# Altium schematic sheet Server Main Power.schdoc
size 491 x 255 mm
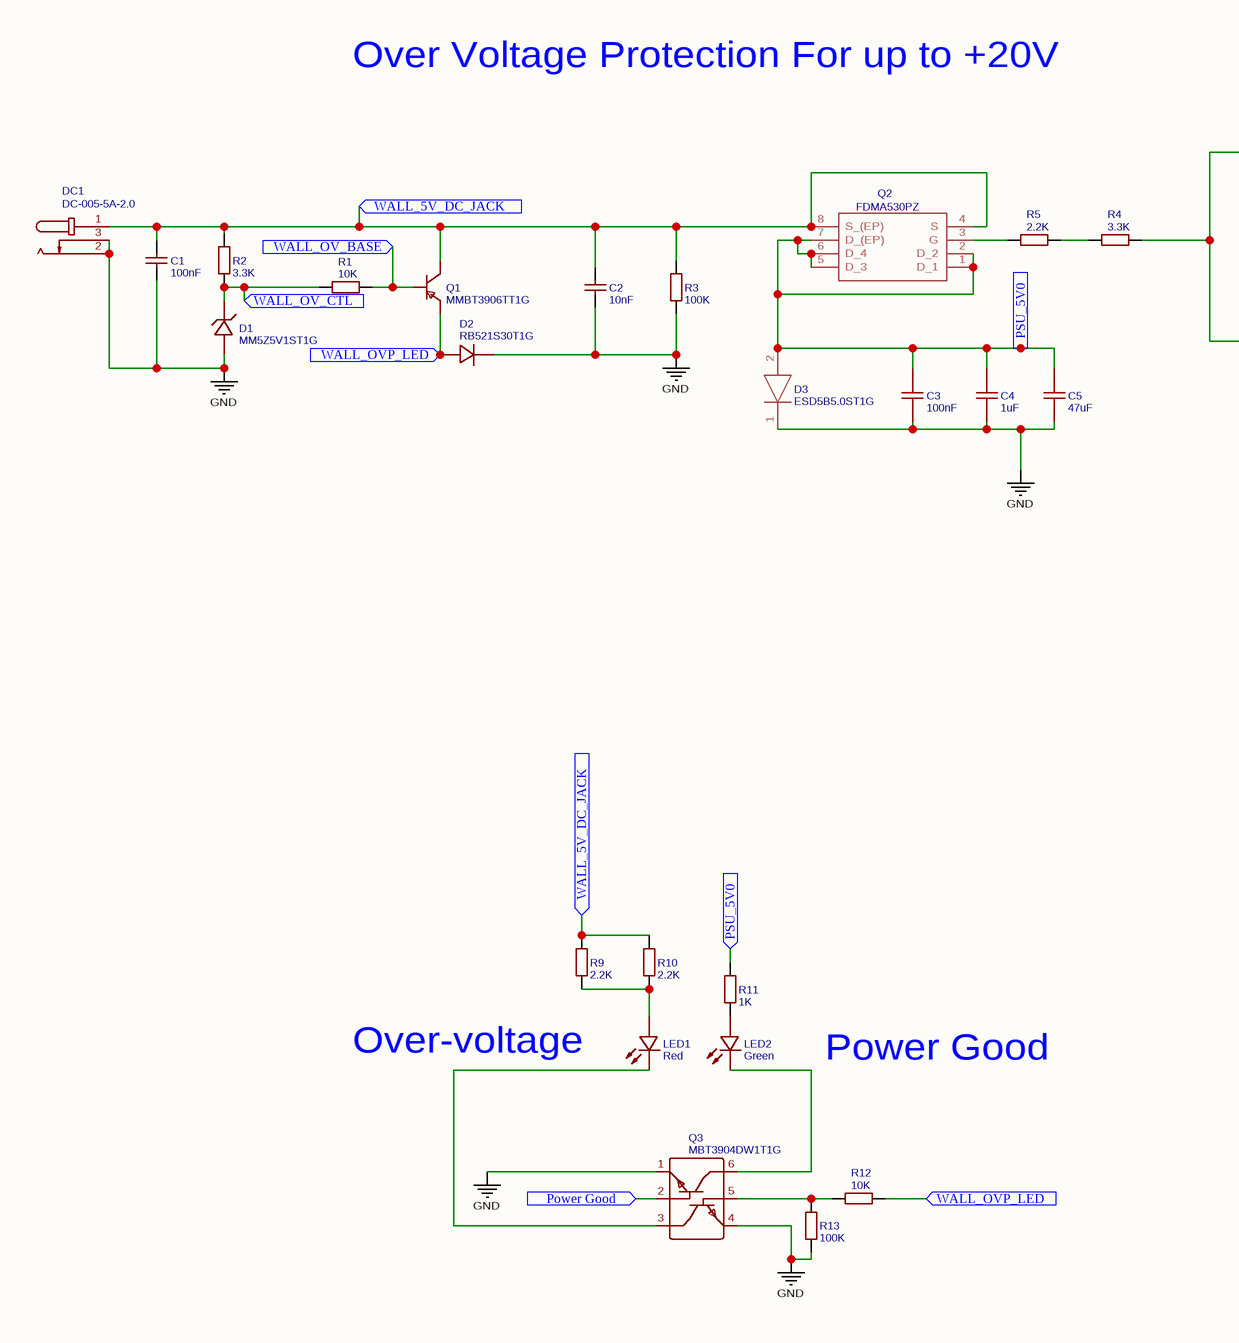
[diagram p0: Server Main Power.schdoc, left]
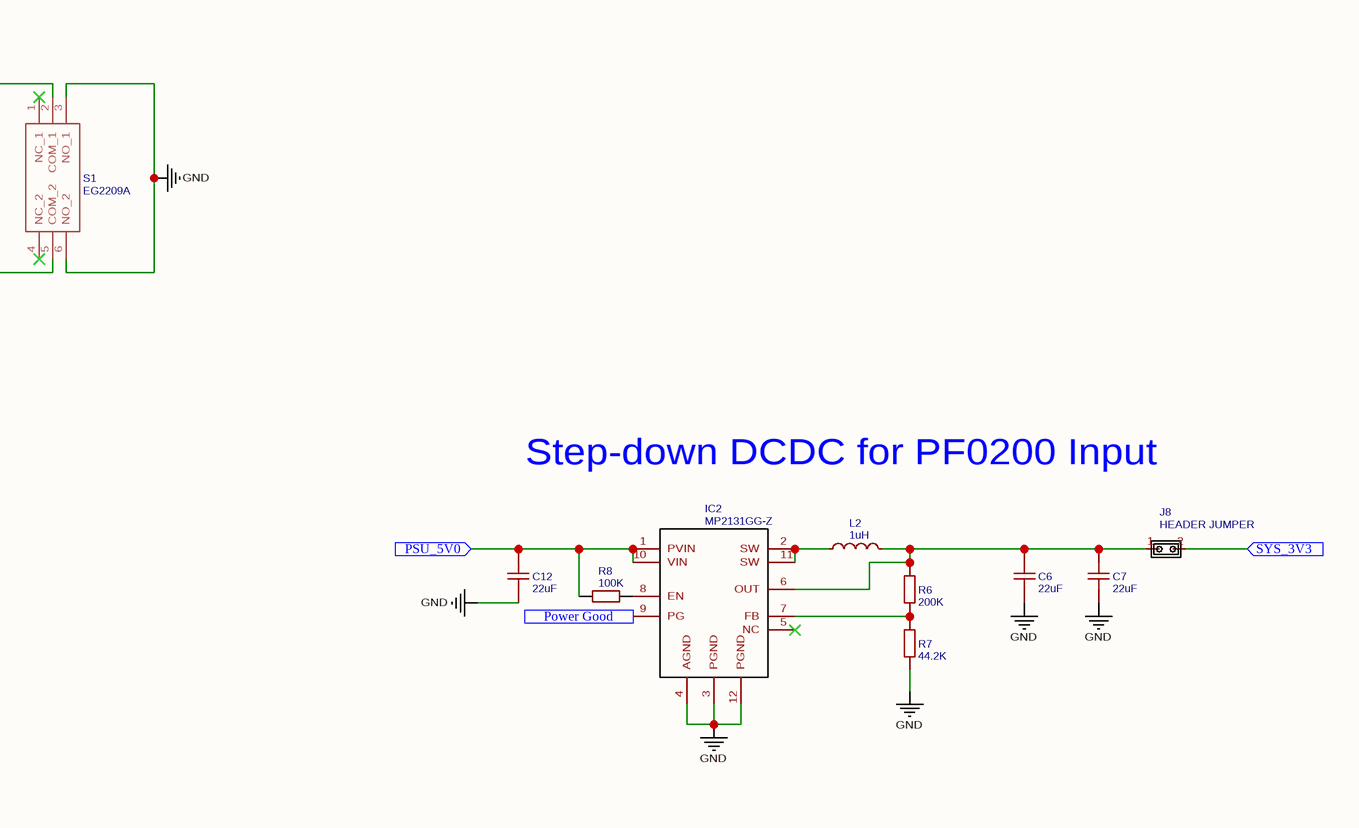
[diagram p1: Server Main Power.schdoc, right]

## Parts
C1  100nF  [C1206]
C2  10nF  [C0402]
C3  100nF  [C0603]
C4  1uF  [C0402]
C5  47uF  [C1206]
C6  22uF  [C0805]
C7  22uF  [C0805]
C12  22uF  [C0805]
D1  MM5Z5V1ST1G  [SOD-523F_L1.7-W0.9-LS1.7-RD]
D2  RB521S30T1G  [SOD-523_L1.2-W0.8-LS1.6-RD]
D3  ESD5B5.0ST1G  [SODFL1608X70N]
DC1  DC-005-5A-2.0  [DC-IN-TH_DC-005-5A-2.0]
IC2  MP2131GG-Z  [MP2131GGZ]
J8  HEADER JUMPER  [HDR1X2]
L2  1uH  [IND-SMD_L11.5-W10.5_MWSA1004]
LED1  Red  [LED0805-RD]
LED2  Green  [LED0805-RD]
Q1  MMBT3906TT1G  [SC-75-3_L1.6-W0.8-P1.00-LS1.7-BR]
Q2  FDMA530PZ  [MICROFET(2X2)]
Q3  MBT3904DW1T1G  [SOT-363_L2.0-W1.3-P0.65-LS2.1-TL]
R1  10K  [R0603]
R2  3.3K  [R0402]
R3  100K  [R0603]
R4  3.3K  [R0402]
R5  2.2K  [R0402]
R6  200K  [R0603]
R7  44.2K  [R1206]
R8  100K  [R0603]
R9  2.2K  [R0402]
R10  2.2K  [R0402]
R11  1K  [R0402]
R12  10K  [R0402]
R13  100K  [R0603]
S1  EG2209A  [EG2209A]

## Ports
Power Good (in), PSU_5V0 (in), SYS_3V3 (in), WALL_5V_DC_JACK (in), WALL_OV_BASE (in), WALL_OV_CTL (in), WALL_OVP_LED (in)

## Nets
GND: C1.1 C2.1 C3.1 C4.1 C5.1 C6.2 C7.1 C12.1 D1.2(A) D2.1(C) D3.1(K) DC1.2 DC1.3 IC2.3(PGND) IC2.4(AGND) IC2.12(PGND) Q3.1 Q3.4 R3.1 R7.1 R13.1 S1.3(NO_1) S1.6(NO_2)
Power Good: IC2.9(PG) Q3.2 ; port Power Good
PSU_5V0: C3.2 C4.2 C5.2 C12.2 D3.2(A) IC2.1(PVIN) IC2.10(VIN) Q2.1(D_1) Q2.2(D_2) Q2.5(D_3) Q2.6(D_4) Q2.7(D_(EP)) R8.1 R11.2 ; port PSU_5V0
SYS_3V3: J8.2 ; port SYS_3V3
WALL_5V_DC_JACK: C1.2 C2.2 DC1.1 Q1.3(C) Q2.4(S) Q2.8(S_(EP)) R2.2 R3.2 R9.2 R10.2 ; port WALL_5V_DC_JACK
WALL_OV_BASE: Q1.1(B) R1.2 ; port WALL_OV_BASE
WALL_OV_CTL: D1.1(K) R1.1 R2.1 ; port WALL_OV_CTL
WALL_OVP_LED: D2.2(A) Q1.2(E) R12.2 ; port WALL_OVP_LED
NetC6_1: C6.1 C7.2 IC2.6(OUT) J8.1 L2.2 R6.2
NetIC2_2: IC2.2(SW) IC2.11(SW) L2.1
NetIC2_7: IC2.7(FB) R6.1 R7.2
NetIC2_8: IC2.8(EN) R8.2
NetLED1_1: LED1.1(-) Q3.3
NetLED1_2: LED1.2(+) R9.1 R10.1
NetLED2_1: LED2.1(-) Q3.6
NetLED2_2: LED2.2(+) R11.1
NetQ2_3: Q2.3(G) R5.2
NetQ3_5: Q3.5 R12.1 R13.2
NetR4_1: R4.1 S1.2(COM_1) S1.5(COM_2)
NetR4_2: R4.2 R5.1

Not connected (* = marked no-connect by the designer): IC2 5(NC)*; S1 1(NC_1)* 4(NC_2)*

## Notes on the sheet
- Over Voltage Protection For up to +20V
- Step-down DCDC for PF0200 Input
- (near R9) Over-voltage
- Power Good

## Library data of the parts
C1 = 100nF: BOM_Manufacturer Part: CL31B104KBCNNNC; BOM_Manufacturer: SAMSUNG; nameAlias: Capacitance; SMT Type: Basic; BOM_Supplier: LCSC; BOM_LCSC Assembly: Yes; BOM_Supplier Part: C24497; spicePre: C; spiceSymbolName: CL31B104KBCNNNC
C2 = 10nF: BOM_Manufacturer Part: CL05B103KB5NNNC; BOM_Manufacturer: SAMSUNG; nameAlias: Capacitance; SMT Type: Basic; BOM_Supplier: LCSC; BOM_LCSC Assembly: Yes; BOM_Supplier Part: C15195; spicePre: C; spiceSymbolName: CL05B103KB5NNNC
C3 = 100nF: BOM_Manufacturer: YAGEO; BOM_Manufacturer Part: CC0603KRX7R9BB104; nameAlias: Capacitance; SMT Type: Basic; BOM_Supplier: LCSC; BOM_LCSC Assembly: Yes; BOM_Supplier Part: C14663; spicePre: C; spiceSymbolName: CC0603KRX7R9BB104
C4 = 1uF: BOM_Manufacturer: SAMSUNG; BOM_Manufacturer Part: CL05A105KA5NQNC; nameAlias: Capacitance; SMT Type: Basic; BOM_Supplier: LCSC; BOM_LCSC Assembly: Yes; BOM_Supplier Part: C52923; spicePre: C; spiceSymbolName: CL05A105KA5NQNC
C5 = 47uF: BOM_Manufacturer: SAMSUNG; BOM_Manufacturer Part: CL31A476MPHNNNE; nameAlias: Capacitance; SMT Type: Basic; BOM_Supplier: LCSC; BOM_Supplier Part: C96123; BOM_LCSC Assembly: Yes; spicePre: C; spiceSymbolName: CL31A476MPHNNNE
C6 C7 C12 = 22uF: BOM_Manufacturer: Samsung Electro-Mechanics; nameAlias: Capacitance; Contributor: LCSC; BOM_Supplier: LCSC; BOM_Supplier Part: C19704; BOM_Manufacturer Part: -; spicePre: C; spiceSymbolName: 22uF ±20% 10V
D1 = MM5Z5V1ST1G: BOM_Manufacturer: ON; SMT Type: Extend; BOM_Supplier: LCSC; BOM_Manufacturer Part: MM5Z5V1ST1G; BOM_Supplier Part: C94383; BOM_LCSC Assembly: Yes; spicePre: D; spiceSymbolName: MM5Z5V1ST1G
D2 = RB521S30T1G: BOM_Manufacturer: ON Semicon; Contributor: LCSC; SMT Type: Extend; BOM_Supplier: LCSC; BOM_Supplier Part: C145179; BOM_Manufacturer Part: RB521S30T1G; BOM_LCSC Assembly: Yes; spicePre: D; spiceSymbolName: RB521S30T1G
D3 = ESD5B5.0ST1G: Contributor: Ke'Ondrae_Mell; spicePre: D; spiceSymbolName: ESD5B5.0ST1G
DC1 = DC-005-5A-2.0: BOM_Manufacturer: XKB Enterprise; Contributor: LCSC; BOM_Supplier: LCSC; BOM_Supplier Part: C381116; BOM_Manufacturer Part: DC-005-5A-2.0; spicePre: D; spiceSymbolName: DC-005-5A-2.0
IC2 = MP2131GG-Z: Contributor: Ke'Ondrae_Mell; spicePre: I; spiceSymbolName: MP2131GG-Z
J8 = HEADER JUMPER: Contributor: iinnovations; sourceId: 5aKIigQpn; timeStamp: 1467472897; spicePre: J; spiceSymbolName: HEADER JUMPER
L2 = 1uH: BOM_Manufacturer: Sunlord; BOM_Manufacturer Part: MWSA1004-1R0MT; nameAlias: Inductance; Contributor: LCSC; SMT Type: Extend; BOM_Supplier: LCSC; BOM_Supplier Part: C151871; BOM_LCSC Assembly: Yes; spicePre: L; spiceSymbolName: MWSA1004-1R0MT
LED1 = Red: BOM_Manufacturer: NATIONSTAR; BOM_Manufacturer Part: FC-2012HRK-620D; SMT Type: Basic; BOM_Supplier: LCSC; image: //image.lceda.cn/szlcsc/C84256.jpg; BOM_Supplier Part: C84256; BOM_LCSC Assembly: Yes; spicePre: L; spiceSymbolName: FC-2012HRK-620D
LED2 = Green: BOM_Manufacturer: NATIONSTAR; BOM_Manufacturer Part: FC-2012HRK-620D; SMT Type: Basic; BOM_Supplier: LCSC; image: //image.lceda.cn/szlcsc/C84256.jpg; BOM_Supplier Part: C84256; BOM_LCSC Assembly: Yes; spicePre: L; spiceSymbolName: FC-2012HRK-620D
Q1 = MMBT3906TT1G: BOM_Manufacturer: ON; SMT Type: Extend; BOM_Supplier: LCSC; BOM_Manufacturer Part: MMBT3906TT1G; image: //image.lceda.cn/szlcsc/C82042.jpg; BOM_Supplier Part: C82042; BOM_LCSC Assembly: Yes; spicePre: Q; spiceSymbolName: MMBT3906TT1G
Q2 = FDMA530PZ: Contributor: Ke'Ondrae_Mell; spicePre: Q; spiceSymbolName: FDMA530PZ
Q3 = MBT3904DW1T1G: BOM_Manufacturer: ON; SMT Type: Extend; BOM_Supplier: LCSC; BOM_Manufacturer Part: MBT3904DW1T1G; BOM_Supplier Part: C110150; BOM_LCSC Assembly: Yes; spicePre: Q; spiceSymbolName: MBT3904DW1T1G
R1 = 10K: BOM_Manufacturer: UniOhm; BOM_Manufacturer Part: 0603WAF1002T5E; nameAlias: Resistance (Ohms); SMT Type: Basic; BOM_Supplier: LCSC; BOM_LCSC Assembly: Yes; BOM_Supplier Part: C25804; spicePre: R; spiceSymbolName: 0603WAF1002T5E
R2 R4 = 3.3K: BOM_Manufacturer: UniOhm; BOM_Manufacturer Part: 0402WGF3301TCE; nameAlias: Resistance (Ohms); SMT Type: Basic; BOM_Supplier: LCSC; BOM_LCSC Assembly: Yes; BOM_Supplier Part: C25890; spicePre: R; spiceSymbolName: 0402WGF3301TCE
R3 R8 R13 = 100K: BOM_Manufacturer: UniOhm; BOM_Manufacturer Part: 0603WAF1003T5E; nameAlias: Resistance (Ohms); SMT Type: Basic; BOM_Supplier: LCSC; BOM_LCSC Assembly: Yes; BOM_Supplier Part: C25803; spicePre: R; spiceSymbolName: 0603WAF1003T5E
R5 = 2.2K: BOM_Manufacturer: UniOhm; BOM_Manufacturer Part: 0402WGF2201TCE; nameAlias: Resistance (Ohms); SMT Type: Basic; BOM_Supplier: LCSC; BOM_LCSC Assembly: Yes; BOM_Supplier Part: C25879; spicePre: R; spiceSymbolName: 0402WGF2201TCE
R6 = 200K: BOM_Manufacturer: UniOhm; BOM_Manufacturer Part: TC0325F2003T5E; nameAlias: Resistance (Ohms); Contributor: LCSC; SMT Type: Extend; BOM_Supplier: LCSC; BOM_Supplier Part: C133268; BOM_LCSC Assembly: Yes; spicePre: R; spiceSymbolName: TC0325F2003T5E
R7 = 44.2K: BOM_Manufacturer: Uniroyal Elec; BOM_Manufacturer Part: 1206W4F4422T5E; nameAlias: Resistance (Ohms); Contributor: LCSC; SMT Type: Extend; BOM_Supplier: LCSC; BOM_Supplier Part: C247257; BOM_LCSC Assembly: Yes; spicePre: R; spiceSymbolName: 1206W4F4422T5E
R9 R10 = 2.2K: BOM_Manufacturer: FH; BOM_Manufacturer Part: RS-02K222JT; nameAlias: Resistance (Ohms); BOM_Supplier: LCSC; BOM_Supplier Part: C140191; spicePre: R; spiceSymbolName: RS-02K222JT
R11 = 1K: BOM_Manufacturer: UniOhm; BOM_Manufacturer Part: 0402WGF1001TCE; nameAlias: Resistance (Ohms); SMT Type: Basic; BOM_Supplier: LCSC; BOM_LCSC Assembly: Yes; BOM_Supplier Part: C11702; spicePre: R; spiceSymbolName: 0402WGF1001TCE
R12 = 10K: BOM_Manufacturer: UniOhm; BOM_Manufacturer Part: 0402WGF1002TCE; nameAlias: Resistance (Ohms); SMT Type: Basic; BOM_Supplier: LCSC; BOM_LCSC Assembly: Yes; BOM_Supplier Part: C25744; spicePre: R; spiceSymbolName: 0402WGF1002TCE
S1 = EG2209A: spicePre: S; spiceSymbolName: EG2209A